# EAGLE schematic neopixel_square (EAGLE 8.6.1)
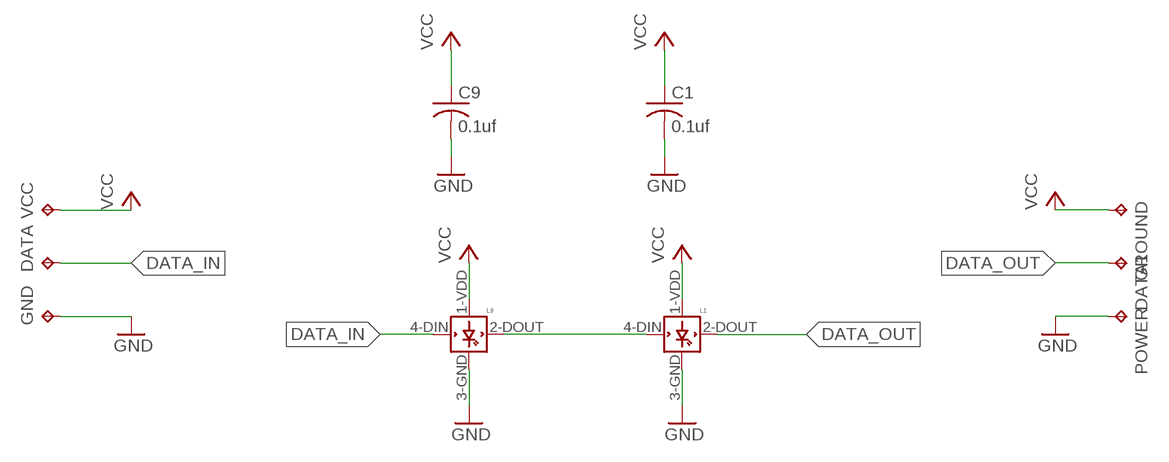
[diagram p0: schematic, sheet 1]

## Parts
C1  0.1uf  C-USC0603  [C0603]
C9  0.1uf  C-USC0603  [C0603]
DATA  TPTP18R  [TP18R]
DATA1  TPTP18R  [TP18R]
GND  TPTP18SQ  [TP18SQ]
GROUND  TPTP18R  [TP18R]
L1  WS2812B  [WS2812B]
L9  WS2812B  [WS2812B]
POWER  TPTP18SQ  [TP18SQ]
VCC  TPTP18R  [TP18R]

## Nets
DATA_IN: DATA.TP L9.4-DIN(DIN)
DATA_OUT: DATA1.TP L1.2-DOUT(DOUT)
GND: C1.2 C9.2 GND.TP L1.3-GND(GND) L9.3-GND(GND) POWER.TP
N$1: L1.4-DIN(DIN) L9.2-DOUT(DOUT)
VCC: C1.1 C9.1 GROUND.TP L1.1-VDD(VDD) L9.1-VDD(VDD) VCC.TP

## Library data of the parts
C1 C9 = rcl:C-US: CAPACITOR, American symbol; SPICEPREFIX: C
DATA DATA1 GND GROUND POWER VCC = testpad:TP: Test pad
L1 L9 = Duly_Drive-FINAL:WS2812B; SPICEPREFIX: E